# EAGLE design source_eagle (EAGLE 9.2.0)
COMPANY: ADAFRUIT INDUSTRIES; DRAWN: KTOWN; REV: A
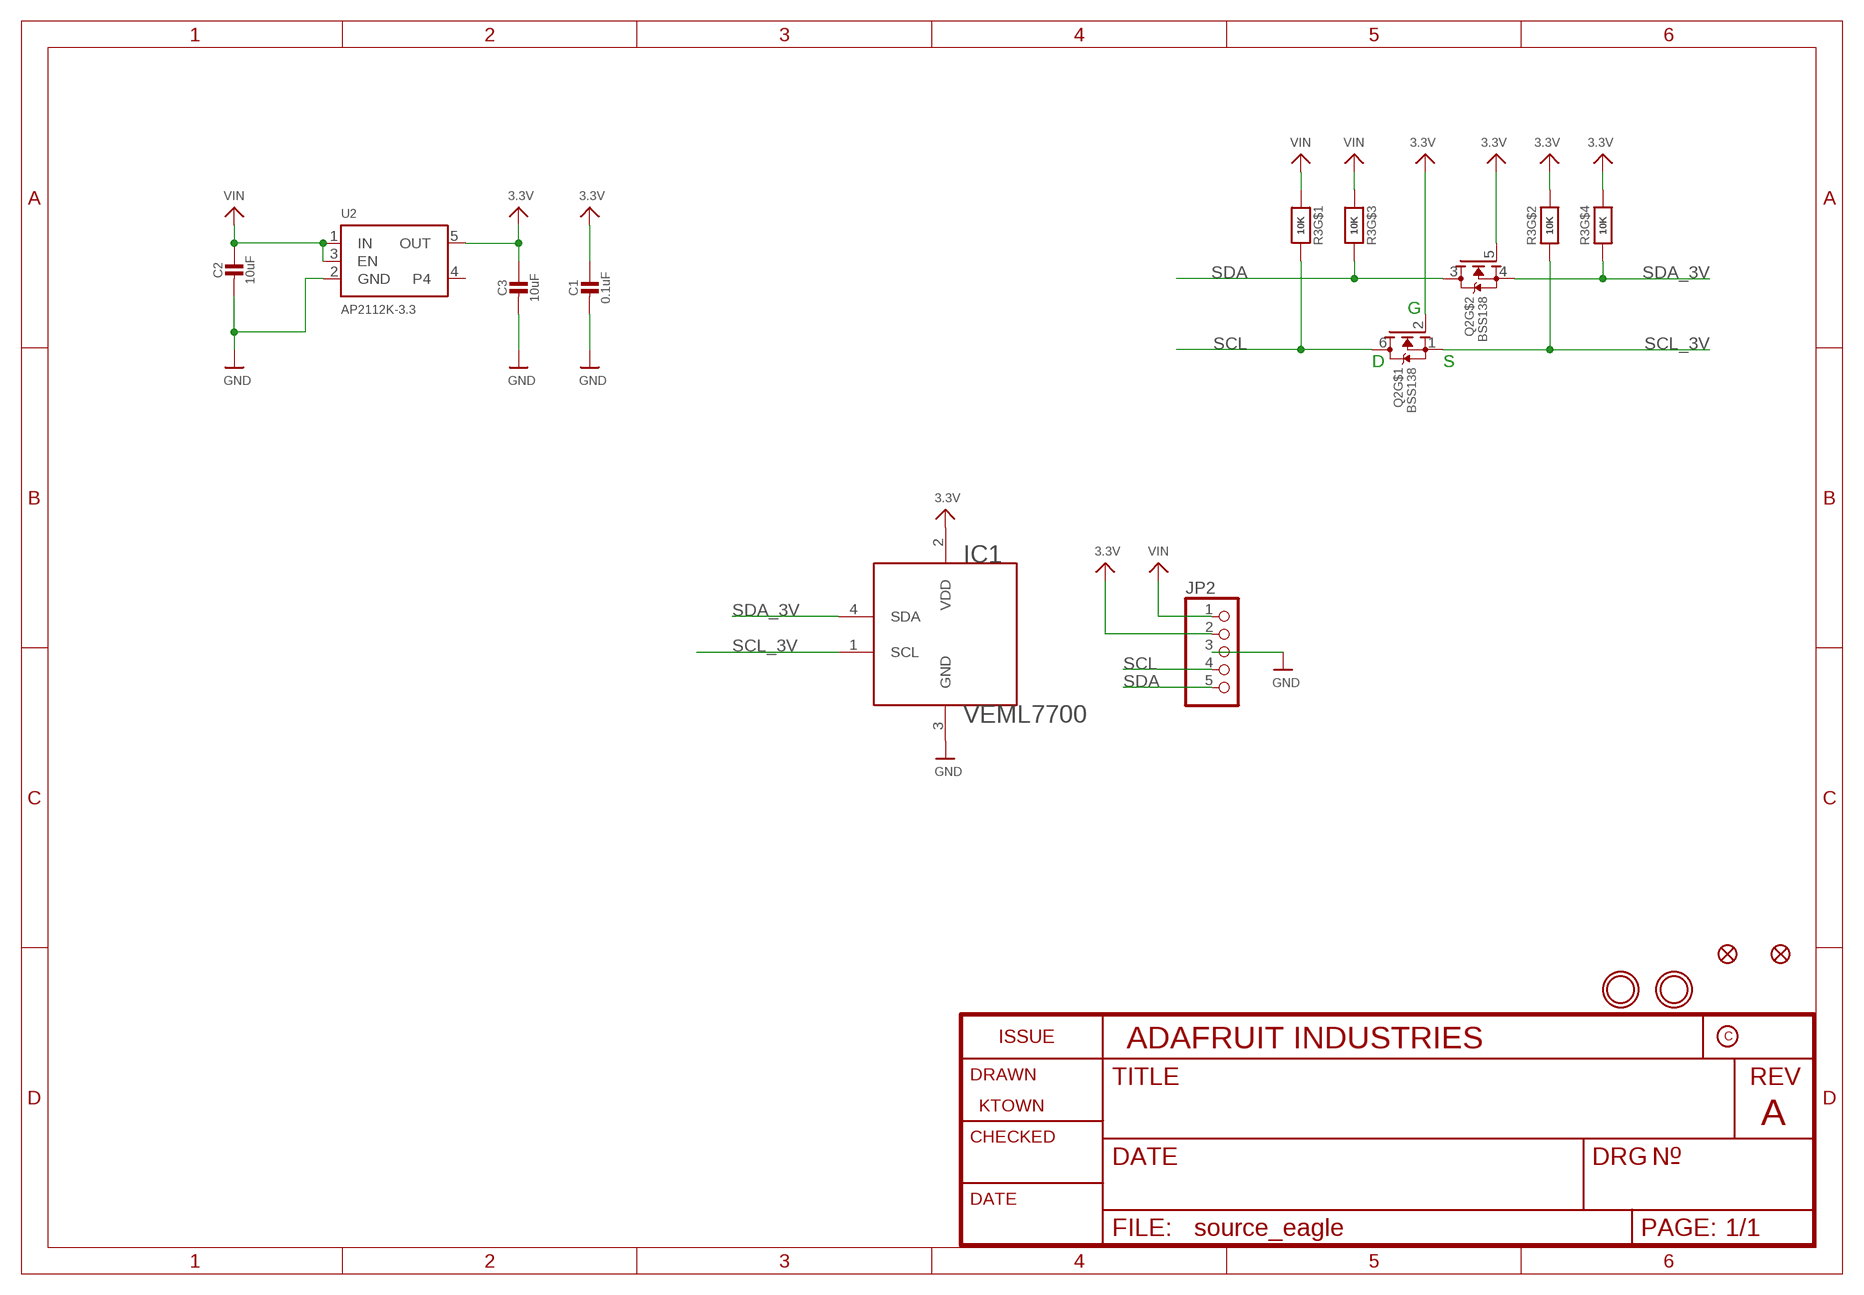
[diagram p0: schematic, sheet 1]

## Parts
C1  0.1uF  CAP_CERAMIC0603_NO  [0603-NO]
C2  10uF  CAP_CERAMIC0805-NOOUTLINE  [0805-NO]
C3  10uF  CAP_CERAMIC0805-NOOUTLINE  [0805-NO]
FID1  FIDUCIAL_1MM  [FIDUCIAL_1MM]
FID2  FIDUCIAL_1MM  [FIDUCIAL_1MM]
IC1  VEML7700  [VEML7700]
JP2  HEADER-1X5ROUND  [1X05_ROUND]
Q2  BSS138  MOSFET-N_DUAL  [SOT363]
R3  10K  RESISTOR_4PACK  [RESPACK_4X0603]
U2  AP2112K-3.3  VREG_SOT23-5  [SOT23-5]
U$3  MOUNTINGHOLE2.5  [MOUNTINGHOLE_2.5_PLATED]
U$4  MOUNTINGHOLE2.5  [MOUNTINGHOLE_2.5_PLATED]

## Nets
3.3V: C1.1 C3.1 IC1.2(VDD) JP2.2 Q2.2(G) Q2.5(G) R3.2 R3.4 U2.5(OUT)
GND: C1.2 C2.2 C3.2 IC1.3(GND) JP2.3 U2.2(GND)
SCL: JP2.4 Q2.6(D) R3.8
SCL_3V: IC1.1(SCL) Q2.1(S) R3.7
SDA: JP2.5 Q2.3(D) R3.6
SDA_3V: IC1.4(SDA) Q2.4(S) R3.5
VIN: C2.1 JP2.1 R3.1 R3.3 U2.1(IN) U2.3(EN)
Unconnected: U2.4

## Notes on the sheet
- G
- D | S

## Library data of the parts
C1-C3 = microbuilder:CAP_CERAMIC: Ceramic Capacitors For new designs, use the packages preceded by an '_' character since they are more reliable: The following footprints should be used on most boards: _0402 - Standard footprint for regular board layouts _0603 - Standard footprint for regular board layouts _0805 - Standard footprint for regular board layouts _1206 - Standard footprint for regular board layouts For extremely tight-pitch boards where space is at a premium, the following 'micro-pitch' footprints can be used (smaller pads, no silkscreen outline, etc.): _0402MP - Micro-pitch footprint for very dense/compact boards _0603MP - Micro-pitch footprint for very dense/compact boards _0805MP - Micro-pitch footprint for very dense/compact boards _1206MP - Micro-pitch footprint for very dense/compact boards
FID1 FID2 = microbuilder:FIDUCIAL: Fiducial Alignment Points Various fiducial points for machine vision alignment.; BOM: EXCLUDE
IC1 = VEML7700:VEML7700
JP2 = microbuilder:HEADER-1X5: PIN HEADER
Q2 = microbuilder:MOSFET-N_DUAL: Dual N-Channel MOSFET SOT363 (2.0x1.25mm) 2N7002PS - 60V, 320mA [Digikey: 568-5984-1-ND]
R3 = microbuilder:RESISTOR_4PACK: Resistor Packs (4 resistors) 4 x 0603 10K 1/16W - Digikey: YC164J-10KCT-ND
U2 = microbuilder:VREG_SOT23-5: SOT23-5 Fixed Voltage Regulators Part Current Out V Out V In V Dropout θJA (°C/W) TJ (°C) Digikey Part No. ADP121 150mA 3.3V 3.4-5.5V 0.09V @ 150mA -- -- ADP121-AUJZ33R7CT-ND ADP121 150mA 3.0V 3.1-5.5V 0.09V @ 150mA -- -- ADP121-AUJZ30R7CT-ND ADP122 300mA 3.3V 3.4-5.5V 0.085V @ 300mA -- -- ADP122AUJZ-3.3-R7CT-ND ADP1712 300mA 3.3V 3.5-5.5V 0.17V @ 300mA -- -- ADP1712AUJZ-3.3-R7TR-ND AP7311 (Low Cost) 150mA 3.3V 3.5-6V 0.15V @ 150mA -- -- AP7311-33WG-7DICT-ND LD39015M18R 150mA 1.8V 1.9V-5.5V 0.08V @ 100mA -- -- 497-6977-1-ND LP2985A-33DBVR 150mA 3.3V 3.3-16V 0.28V @ 150mA 206 150 296-18479-1-ND MCP1824T-3302E/OT 300mA 3.3V 3.5V-6V 0.2V @ 300mA -- -- MCP1824T-3302E/OTCT-ND MIC5205-2.5YM5 TR 150mA 2.5V 2.7-16V 0.165V @ 150mA -- -- 576-1257-2-ND MIC5205-3.0YM5 TR 150mA 3.0V 3.2V-16V 0.165V @ 150mA -- -- 576-1258-2-ND MIC5205-3.3YM5 TR 150mA 3.3V 3.5V-16V 0.165V @ 150mA -- -- 576-1259-2-ND TPS780330220 150mA 3.3V+2.2V 3.6-5.5V 250mV Max -- -- 296-23332-1-ND TDA3663/N1,135 100mA 3.3V 3.5-45V 0.18V @ 50mA -- -- 568-5343-1-ND Max operating temp can be calculated using θJA, TJ (max junction temperature), and power in watts. Set the "Maximum Ambient Temperature" until it reaches TJ ("Max Junction Temperature"), which is the absolute limit for safe use of the regulator: Heat Sink Temperature Calculator <http://www.daycounter.com/Calculators/Heat-Sink-Temperature-Calculator.phtml> For example, With 12V source into a 3.3V LP2985 and a 30mA load, we are dissipating (12V-3.3V) * 0.03A = 0.261W. With a θJA of 206 °C/W, a TJ of 150°C, and 261mW we can safely use the chip without a heat sink up to 75°C (=147.1°C Junction Temperature).
U$3 U$4 = microbuilder:MOUNTINGHOLE: Mounting Hole For #2 screws (0.086"/2.18mm width, 0.094"/2.4mm hole) use 2.5mm; BOM: EXCLUDE

## Board
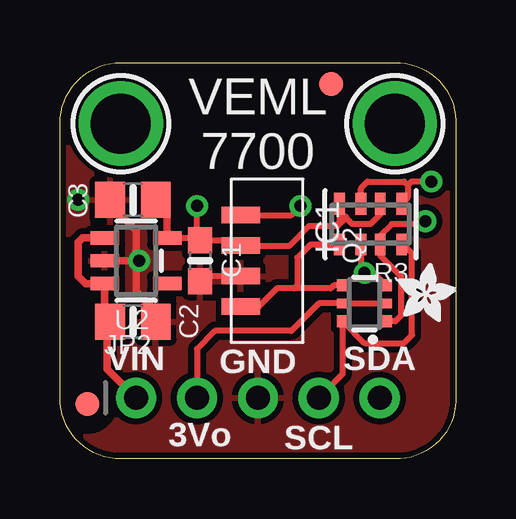
[diagram p1: board, top side]
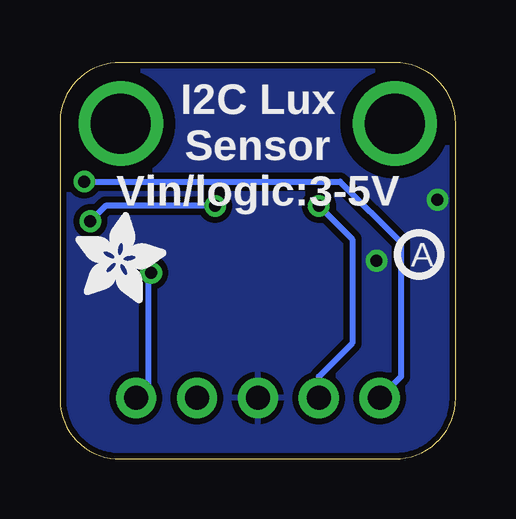
[diagram p2: board, bottom side, seen from below]

Size 16.51 x 16.51 mm. Coordinates in mm from the lower left corner, seen from the top.
Outline: 16.51,14.1 16.51,2.41 arc-90 13.97,0 2.54,0 arc-90 0,2.54 0,13.97 arc-90 2.54,16.51 13.97,16.51 arc-90 16.51,14.1
Copper layers (1*16): Top 0.035mm / dielectric 1.5mm / Bottom 0.035mm
Design rules "adafruit *": minimum track width 8mil, minimum drill 15.5mil, track to track 8mil, track to pad 8mil, pad to pad 8mil, via to via 8mil, smd to smd 8mil, copper to edge 10mil, drill to drill 8mil, minimum pad ring 10mil, minimum via ring 8mil, stop-mask expansion 2mil, vias tented up to drill 20mil, thermal gap 10mil

### Footprints (pad centres in the part's own frame; a part is rotated, then mirrored left to right if it is on the bottom)
0603-NO = smd 1.075 x 1: 1 -0.85,0; 2 0.85,0
0805-NO = smd 1.24 x 1.5: 1 -0.95,0; 2 0.95,0
FIDUCIAL_1MM = smd 1 x 1: 1 0,0
VEML7700 = smd 0.7 x 1.6: 1 -1.905,-1.1; 2 -0.635,-1.1; 3 0.635,-1.1; 4 1.905,-1.1
1X05_ROUND = drill 1 pad 1.676: 1 -5.08,0; 2 -2.54,0; 3 0,0; 4 2.54,0; 5 5.08,0
SOT363 = smd 0.5 x 0.5: 1 -0.75,-0.9; 3 0.75,-0.9; 4 0.75,0.9; 6 -0.75,0.9 | smd 0.4 x 0.5: 2 0,-0.9; 5 0,0.9
RESPACK_4X0603 = smd 0.45 x 0.9: 1 -1.3,-0.85; 2 -0.4,-0.85; 3 0.4,-0.85; 4 1.3,-0.85; 5 1.3,0.85; 6 0.4,0.85; 7 -0.4,0.85; 8 -1.3,0.85
SOT23-5 = smd 0.55 x 1.2: 1 -0.95,-1.3; 2 0,-1.3; 3 0.95,-1.3; 4 0.95,1.3; 5 -0.95,1.3
MOUNTINGHOLE_2.5_PLATED = drill 2.5 pad 3.2: P$1 0,0

### Placement (x,y rotation side)
C1  5.84,8.26 270 top
C2  3.05,5.71 0 top
C3  3.05,10.79 180 top
FID1  11.3,15.62 0 top
FID2  1.14,2.29 0 top
IC1  8.64,8.26 270 top
JP2  8.26,2.54 0 top
Q2  12.7,6.48 90 top
R3  12.95,9.78 180 top
U2  3.17,8.26 270 top
U$1  [ADAFRUIT_3.5MM]  15.88,6.48 0 bottom
U$3  2.54,13.97 0 top
U$4  13.97,13.97 0 top
U$8  [ADAFRUIT_2.5MM]  14.1,5.71 0 top
U$12  [KATTNI_STOP]  11.43,7.11 0 bottom
U$27  [PCBFEAT-REV-040]  1.52,8.51 0 bottom

### Tracks (layer width: path | path; a pad name or v marks a point on that pad's centre or on a via)
3.3V  (via drill 0.5)
  Top 0.254: R3.2 13.35,10.18 12.95,9.78 12.19,9.78 11.91,10.06 | R3.4 11.65,9.81 | Q2.2 Q2.5 10.79,6.48 9.65,5.33 6.48,5.33 5.71,4.57 JP2.2 | U2.5 5.74,9.21 C1.1 | C1.1 7.32,9.11 IC1.2 9.58,8.89 10.4,9.71 11.55,9.71 11.58,9.73 | C1.1 5.71,9.23 v5.71,10.54
  Top 0.305: U2.5 4.47,10.32 C3.1 | 11.58,9.73 11.65,9.81 11.91,10.06
  Bottom 0.254: v5.71,10.54 4.32,9.14 4.32,4.83 5.71,3.43 JP2.2
GND  (via drill 0.5)
  Top 0.254: IC1.3 6.06,7.62 C1.2
  Top 0.305: 3.17,8.26 3.17,9.53 2.1,10.6 C3.2 | C2.2 4,6.16 3.17,6.99 3.17,8.26 | U2.2 3.17,8.26
  other vias: 0.76,10.79 3.3,8.26
  pour Top (isolate 0.254): 0,0 0,16.51 16.51,16.51 16.51,0
  pour Bottom (isolate 0.254): 0,0 0,16.51 16.51,16.51 16.51,0
SCL
  Top 0.254: R3.8 14.32,8.93 14.68,8.57 14.68,5.16 14.35,4.83 12.7,4.83 Q2.6 11.8,3.54 JP2.4
SCL_3V  (via drill 0.5)
  Top 0.254: Q2.1 13.98,5.73 14.22,5.97 14.22,7.62 13.35,8.49 R3.7 13.35,9.29 13.84,9.78 15.11,9.78 v15.24,9.91 | IC1.1 9.65,10.16 v10.03,10.54
  Bottom 0.254: v10.03,10.54 14.61,10.54 v15.24,9.91
SDA  (via drill 0.5)
  Top 0.254: Q2.3 12.83,8 12.55,8 | v12.71,7.75 12.55,7.75 12.55,8 | R3.6 12.55,8
  Bottom 0.254: v12.71,7.75 12.83,7.87 12.83,3.04 JP2.5
SDA_3V
  Top 0.254: IC1.4 8.3,6.35 9.05,7.1 9.78,7.1 | Q2.4 11.42,7.23 11.29,7.1 9.78,7.1 | 9.78,7.1 9.91,7.23 9.91,8.38 10.45,8.93 R3.5
VIN  (via drill 0.5)
  Top 0.254: 14.35,11.56 12.83,11.56 12.55,11.28 R3.3 | v15.49,11.56 14.66,11.56 14.51,11.4 | 14.51,11.4 14.35,11.56 | 14.35,11.56 | 14.51,11.4 | 14.51,11.4 14.51,10.88 R3.1
  Top 0.305: JP2.1 1.97,3.74 1.97,5.59 C2.1 1.88,5.94 U2.3 1.08,7.3 0.76,7.62 0.76,9.02 0.95,9.21 | 0.95,9.21 | 0.95,9.21 U2.1
  Bottom 0.254: v15.49,11.56 4.83,11.56 2.29,9.02 2.29,3.43 JP2.1

### Text on the board
tPlace: VEML / 7700 | VIN | GND | SDA | 3Vo | SCL
bPlace: I2C Lux / Sensor / Vin/logic:3-5V